# EAGLE design AmiiboPI (EAGLE 9.6.2)
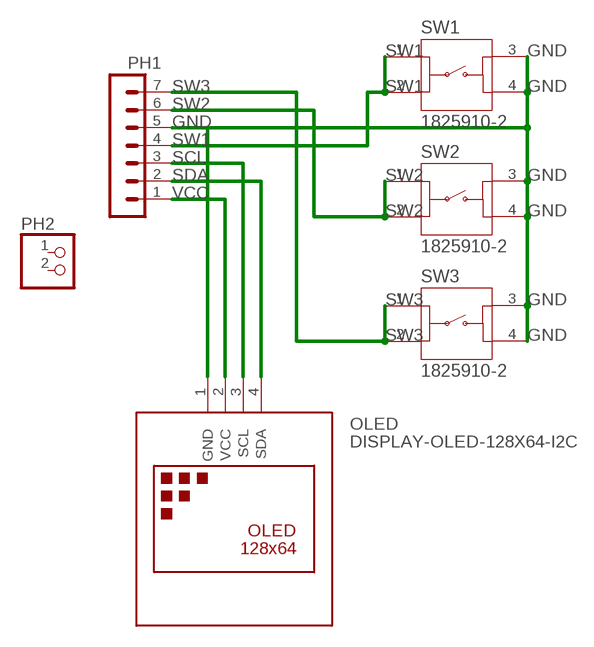
[diagram p0: schematic, sheet 1]

## Parts
OLED  DISPLAY-OLED-128X64-I2C  [DISPLAY-OLED-128X64-I2C]
PH1  MA07-1  [MA07-1]
PH2  PINHD-1X2  [1X02]
SW1  1825910-2  [TE_1825910-2]
SW2  1825910-2  [TE_1825910-2]
SW3  1825910-2  [TE_1825910-2]

## Nets
GND: OLED.1(GND) PH1.5 SW1.3 SW1.4 SW2.3 SW2.4 SW3.3 SW3.4
SCL: OLED.3(SCL) PH1.3
SDA: OLED.4(SDA) PH1.2
SW1: PH1.4 SW1.1 SW1.2
SW2: PH1.6 SW2.1 SW2.2
SW3: PH1.7 SW3.1 SW3.2
VCC: OLED.2(VCC) PH1.1
Unconnected: PH2.1 PH2.2

## Library data of the parts
OLED = diy-modules:DISPLAY-OLED-128X64-I2C: 128x64 Dot Matrix OLED Module based on SSD1306 chip Variant with I2C interface More details available here: http://www.instructables.com/id/Monochrome-096-i2c-OLED-display-with-arduino-SSD13/ SSD1306 datasheet: https://cdn-shop.adafruit.com/datasheets/SSD1306.pdf Click here to find device on ebay.com <http://www.ebay.com/sch/oled+display+128x64+iic> Note: There are two variants: I2C and SPI. Search for the proper version.
PH1 = con-lstb:MA07-1: PIN HEADER; OC_FARNELL: unknown; OC_NEWARK: unknown
PH2 = pinhead:PINHD-1X2: PIN HEADER
SW1-SW3 = 1825910-2:1825910-2: SWITCH TACTILE SPST-NO 0.05A 24V Buy Part <https://snapeda.com/parts/1825910-2/TE%20Connectivity/view-part/?ref=eda>; ARROW_ELECTRONICS-PURCHASE-URL: https://snapeda.com/shop?store=Arrow+Electronics&id=278983; AVAILABILITY: Good; COMMENT: 1825910-2; CONFIGURATION_POLE-THROW: Single Pole - Single Throw; CONTACT_CURRENT_RATING: 50 mA; DESCRIPTION: 50 mA SPST Round Actuator 160 Gram Force Tactile Pushbutton Switch; DIGIKEY-PURCHASE-URL: https://snapeda.com/shop?store=DigiKey&id=278983; EU_ROHS_COMPLIANCE: Compliant; MF: TE Connectivity; MP: 1825910-2; PACKAGE: None; PRICE: None

## Net classes
0 default: width 0.508 mm, clearance 0.127 mm

## Board
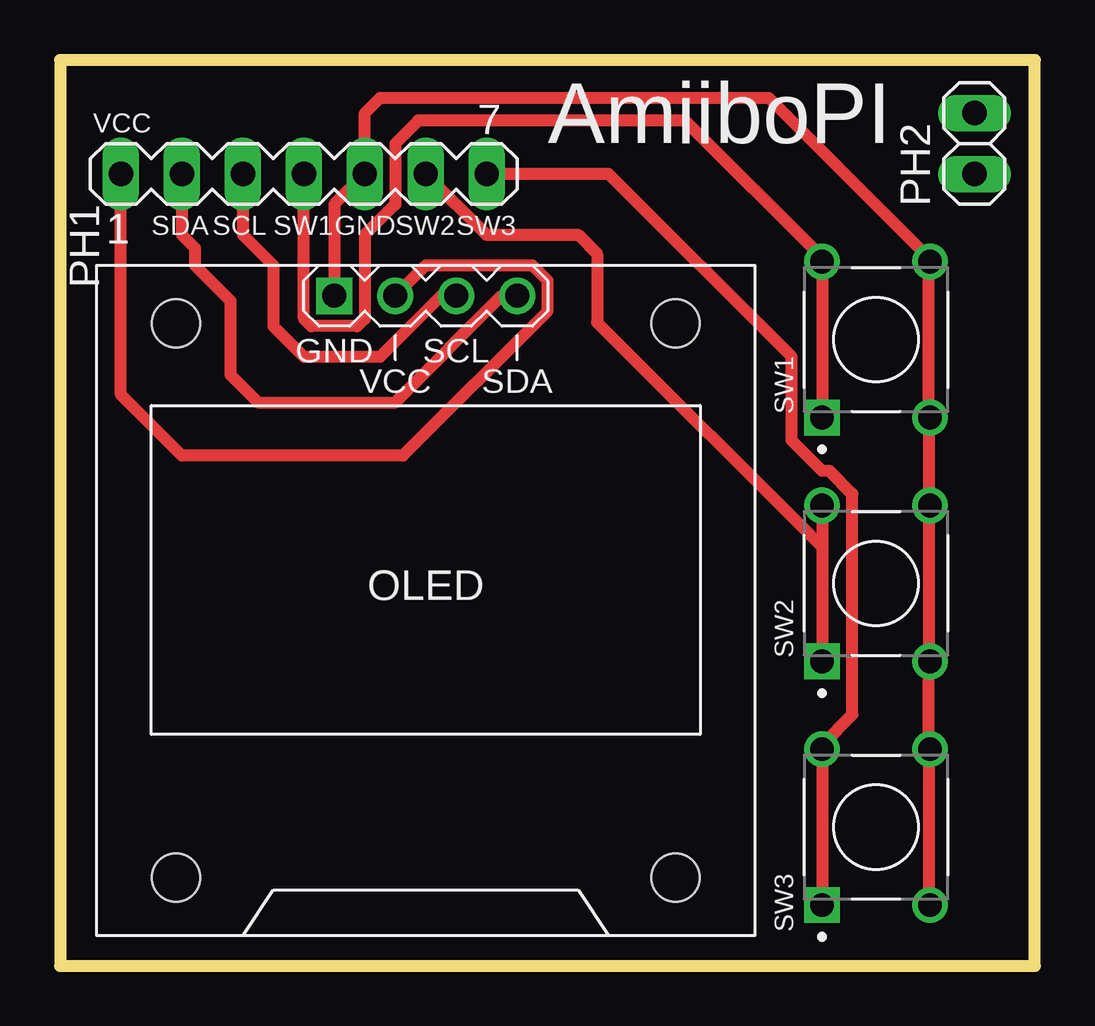
[diagram p1: board, top side]
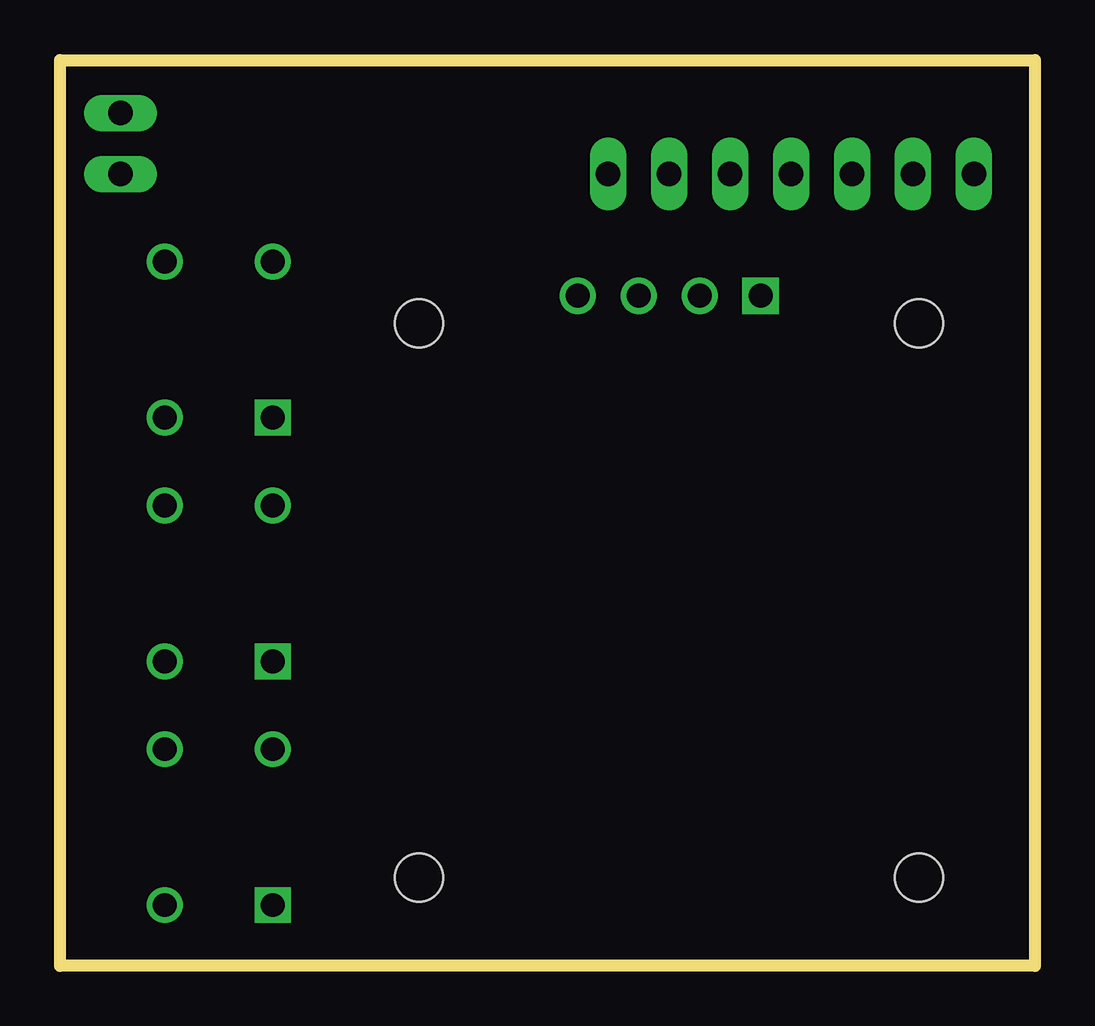
[diagram p2: board, bottom side, seen from below]

Size 40.62 x 37.77 mm. Coordinates in mm from the lower left corner, seen from the top.
Outline: 0,0 40.62,0 40.62,37.77 0,37.77 0,0
Copper layers (1*16): Top 0.035mm / dielectric 1.5mm / Bottom 0.035mm
Design rules "default": minimum track width 6mil, minimum drill 0.35mm, track to track 6mil, track to pad 6mil, pad to pad 6mil, via to via 6mil, smd to smd 6mil, copper to edge 40mil, drill to drill 6mil, minimum pad ring 10mil, minimum via ring 8mil, stop-mask expansion 4mil, vias tented up to drill 0mil, thermal gap 10mil

### Footprints (pad centres in the part's own frame; a part is rotated, then mirrored left to right if it is on the bottom)
DISPLAY-OLED-128X64-I2C = drill 1 square: 1 -3.81,12.7 | drill 1: 2 -1.27,12.7; 3 1.27,12.7; 4 3.81,12.7 | hole 2: -10.414,11.557; 10.414,11.557; 10.414,-11.557; -10.414,-11.557
MA07-1 = drill 1.016 long: 1 -7.62,0; 2 -5.08,0; 3 -2.54,0; 4 0,0; 5 2.54,0; 6 5.08,0; 7 7.62,0
1X02 = drill 1.016 long: 1 -1.27,0; 2 1.27,0
TE_1825910-2 = drill 0.99 square: 1 0,0 | drill 0.99: 2 6.5,0; 3 0,-4.5; 4 6.5,-4.5

### Placement (x,y rotation side)
OLED  15.24,15.24 0 top
PH1  10.16,33.02 0 top
PH2  38.1,34.29 90 top
SW1  31.75,22.86 90 top
SW2  31.75,12.7 90 top
SW3  31.75,2.54 90 top

### Tracks (layer width: path | path; a pad name or v marks a point on that pad's centre or on a via)
GND
  Top 0.508: SW3.3 36.2,2.54 36.2,8.89 SW3.4 36.2,9.21 36.2,12.7 | OLED.1 11.43,31.75 PH1.5 12.7,35.56 13.34,36.2 29.53,36.2 36.2,29.53 SW1.4 36.2,29.21 36.2,22.86 | 36.2,22.86 36.2,19.37 SW2.4 36.2,19.05 36.2,12.7 | 36.2,22.86 SW1.3 | 36.2,12.7 SW2.3
SCL
  Top 0.508: OLED.3 15.88,27.94 13.34,25.4 10.16,25.4 8.89,26.67 8.89,29.21 7.62,30.48 PH1.3
SDA
  Top 0.508: OLED.4 18.41,27.94 13.97,23.5 8.26,23.5 7.1,24.65 7.1,27.74 5.62,29.21 5.62,29.94 5.08,30.48 PH1.2
SW1
  Top 0.508: SW1.1 SW1.2 31.75,29.53 26.04,35.24 14.92,35.24 13.97,34.29 13.97,31.75 12.7,30.48 12.7,26.99 12.38,26.67 10.48,26.67 10.16,26.99 PH1.4
SW2
  Top 0.508: SW2.2 31.75,17.46 | 31.75,17.46 SW2.1 | PH1.6 17.78,30.48 21.59,30.48 22.38,29.69 22.38,26.83 31.75,17.46
  Bottom 0.508: 15.24,32.92 PH1.6
SW3
  Top 0.508: SW3.1 SW3.2 31.75,9.21 33.02,10.48 33.02,19.69 32.07,20.64 31.75,20.64 30.48,21.91 30.48,25.4 22.86,33.02 PH1.7
VCC
  Top 0.508: PH1.1 2.54,23.81 5.08,21.27 14.29,21.27 20.32,27.3 20.32,28.57 19.68,29.21 15.24,29.21 OLED.2

### Text on the board
tPlace: VCC | AmiiboPI | SDA | SCL | SW1 | GND | SW2 | SW3